# Altium schematic sheet SDCard_SPI.SchDoc: SD Card SPI Interface
size A4; Organization: UNSW Solar Racing Team; Address3: UNSW; Address4: Sydney NSW 2052; Address2: Electrical Engineering; Address1: Room 342
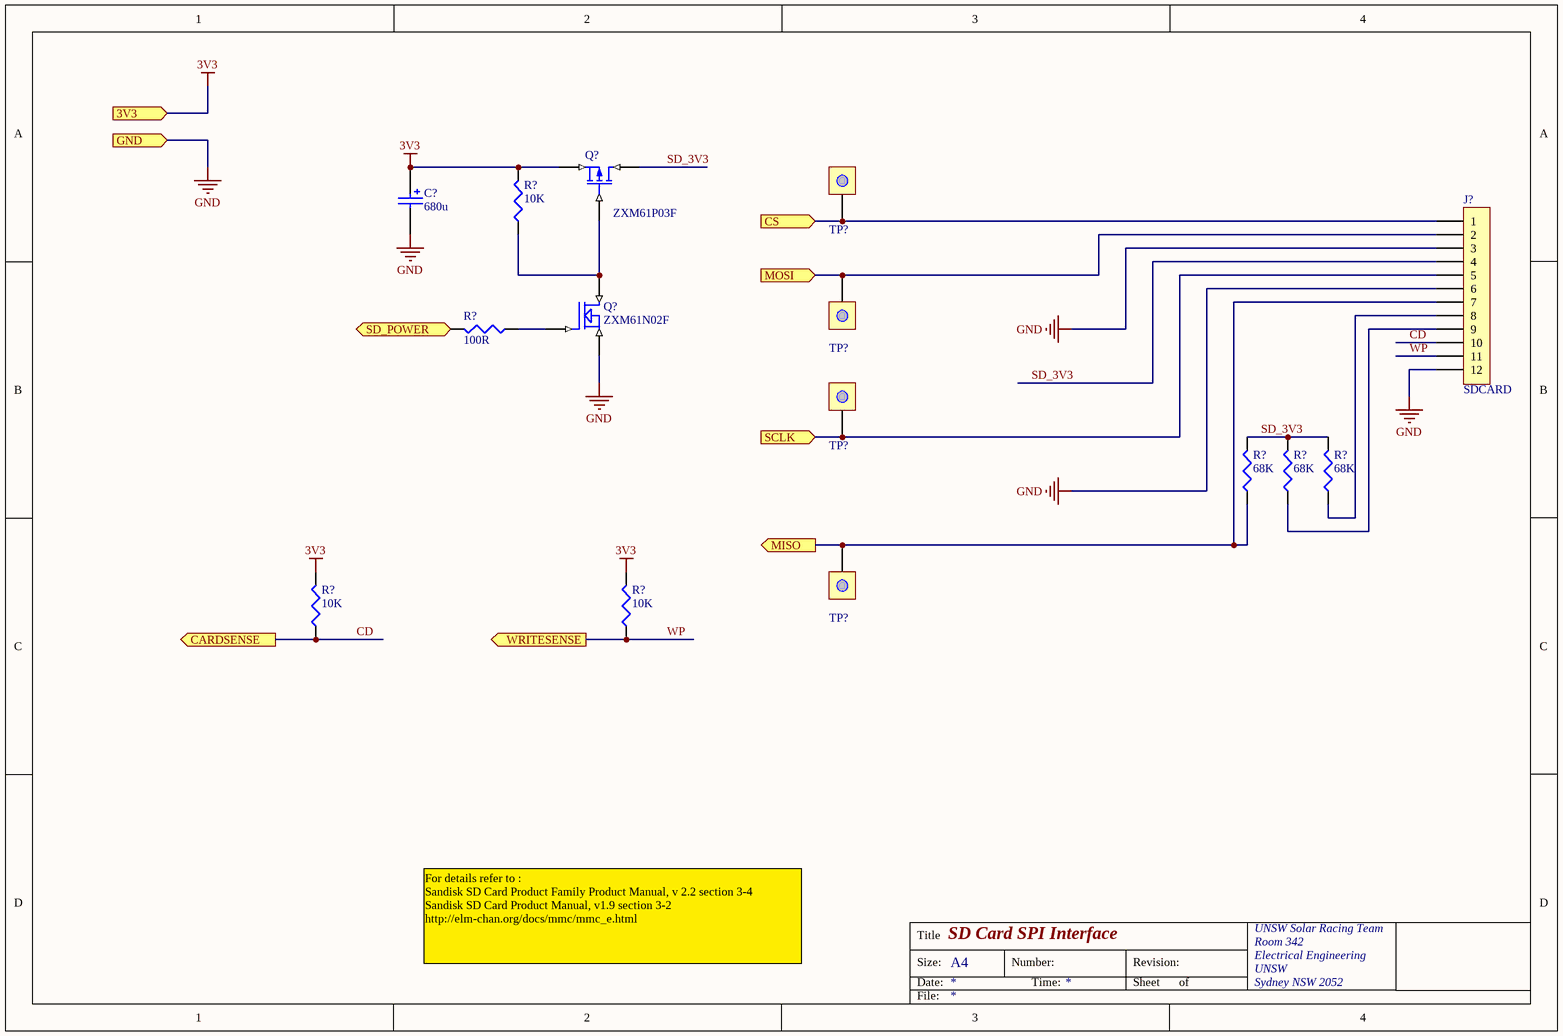
[diagram p0: SDCard_SPI.SchDoc]

## Parts
(Parts that share a designator on the sheet are numbered #1, #2 ... from top to bottom, then left to right.)
C?  680u  [MCCT-CASED]
J?  SDCARD  [SDCARD_AMPHENOL]
Q?#1  ZXM61P03F  [SOT23-3]
Q?#2  ZXM61N02F  [SOT23-3]
R?#1  10K  [0603]
R?#2  100R  [0603]
R?#3  68K  [0603]
R?#4  68K  [0603]
R?#5  68K  [0603]
R?#6  10K  [0603]
R?#7  10K  [0603]
TP?#1  TEST  [TESTPOINT]  (value not drawn)
TP?#2  TEST  [TESTPOINT]  (value not drawn)
TP?#3  TEST  [TESTPOINT]  (value not drawn)
TP?#4  TEST  [TESTPOINT]  (value not drawn)

## Ports
3V3 (in), CARDSENSE (out), CS (in), GND (in), MISO (out), MOSI (in), SCLK (in), SD_POWER (in), WRITESENSE (out)

## Nets
3V3: C?.1 Q?#1.3(D) R?#1.2 R?#6.2 R?#7.2 ; port 3V3
GND: C?.2 J?.3 J?.6 J?.12 Q?#2.2(S) ; port GND
CD: J?.10 R?#6.1 ; port CARDSENSE
CS: J?.1 TP?#1.0(TP) ; port CS
MISO: J?.7 R?#3.1 TP?#4.0(TP) ; port MISO
MOSI: J?.2 TP?#2.0(TP) ; port MOSI
SCLK: J?.5 TP?#3.0(TP) ; port SCLK
SD_3V3: J?.4 Q?#1.2(S) R?#3.2 R?#4.2 R?#5.2
SD_POWER: R?#2.2 ; port SD_POWER
WP: J?.11 R?#7.1 ; port WRITESENSE
NetJ?_8: J?.8 R?#5.1
NetJ?_9: J?.9 R?#4.1
NetQ?#1_1: Q?#1.1(G) Q?#2.3(D) R?#1.1
NetQ?#2_1: Q?#2.1(G) R?#2.1

## Notes on the sheet
- For details refer to :
  Sandisk SD Card Product Family Product Manual, v 2.2 section 3-4
  Sandisk SD Card Product Manual, v1.9 section 3-2
  http://elm-chan.org/docs/mmc/mmc_e.html
- Title
- Size:
- Date:
- A4
- Number:
- Time:
- Revision:
- Sheet
- of
- File:

## Library data of the parts
C? = CAP POL3: Polarized Capacitor (Surface Mount); Manufacturer: Generic Components; Class I: Passive; Value: 100pF; Published: 8-Jun-2000; Revision: July-2002: Re-released for DXP Platform.; Publisher: Altium Limited; Class II: Capacitor
J? = CON12: SD Card Connector w/ Sense; Farnell: 1788476; FarnellPrice: 4.78; Digikey: 101-00405-75-ND; DigikeyPrice: 2.67
Q?#1 = ZXM61P03F: 1.1A, 30V P-Channel Enhancement mode FET
Q?#2 = ZXM61N02F: 1.7A, 20V N-Channel Enhancement mode FET
R?#1-R?#7 = RES1: Resistor
TP?#1-TP?#4 = TEST: TEST POINT